# EAGLE design Eurorack_mini_psu (EAGLE 7.5.0)
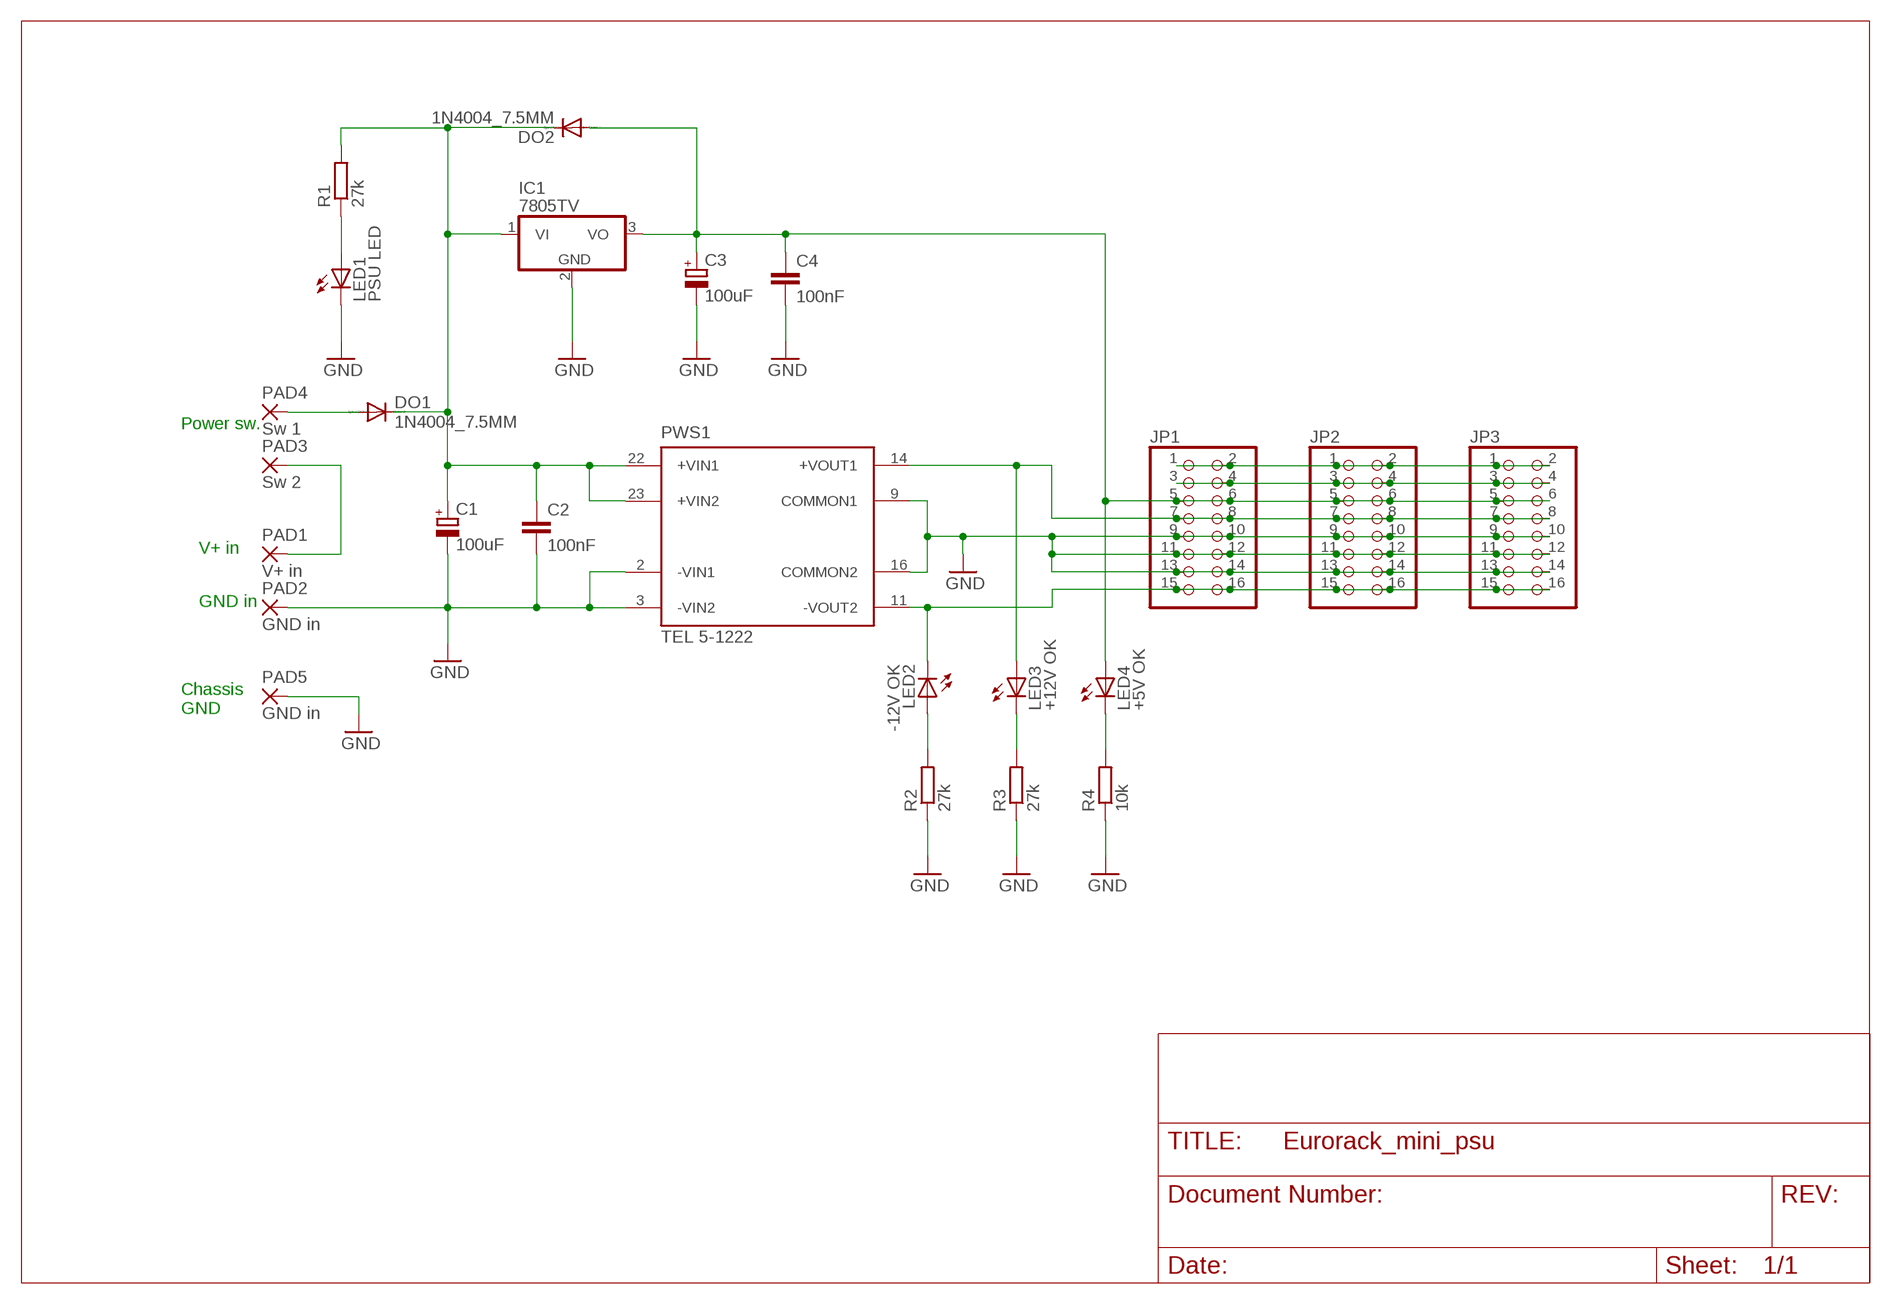
[diagram p0: schematic, sheet 1]

## Parts
C1  100uF  CPOL-EUE2.5-6  [E2,5-6]
C2  100nF  C-EU025-025X050  [C025-025X050]
C3  100uF  CPOL-EUE2.5-6  [E2,5-6]
C4  100nF  C-EU025-025X050  [C025-025X050]
DO1  1N4004_7.5MM  [DO41-7]
DO2  1N4004_7.5MM  [DO41-7]
IC1  7805TV  [TO220V]
JP1  PINHD-2X8  [2X08]
JP2  PINHD-2X8  [2X08]
JP3  PINHD-2X8  [2X08]
LED1  PSU LED  LED3MM  [LED3MM]
LED2  -12V OK  LED3MM  [LED3MM]
LED3  +12V OK  LED3MM  [LED3MM]
LED4  +5V OK  LED3MM  [LED3MM]
PAD1  V+ in  2,15/1,0  [2,15/1,0]
PAD2  GND in  2,15/1,0  [2,15/1,0]
PAD3  Sw 2  2,15/1,0  [2,15/1,0]
PAD4  Sw 1  2,15/1,0  [2,15/1,0]
PAD5  GND in  2,15/1,0  [2,15/1,0]
PWS1  TEL 5-1222  TEN_3--1223  [TEN3XXXX]
R1  27k  R-EU_0207/7  [0207/7]
R2  27k  R-EU_0207/7  [0207/7]
R3  27k  R-EU_0207/7  [0207/7]
R4  10k  R-EU_0207/7  [0207/7]

## Nets
+5V: C3.+ C4.1 DO2.A IC1.3(VO) JP1.5 JP1.6 JP2.5 JP2.6 JP3.5 JP3.6 LED4.A
+12V: JP1.7 JP1.8 JP2.7 JP2.8 JP3.7 JP3.8 LED3.A PWS1.14(+VOUT1)
-12V: JP1.15 JP1.16 JP2.15 JP2.16 JP3.15 JP3.16 LED2.K(C) PWS1.11(-VOUT2)
GND: C1.- C2.2 C3.- C4.2 IC1.2(GND) JP1.9 JP1.10 JP1.11 JP1.12 JP1.13 JP1.14 JP2.9 JP2.10 JP2.11 JP2.12 JP2.13 JP2.14 JP3.9 JP3.10 JP3.11 JP3.12 JP3.13 JP3.14 LED1.K(C) PAD2.1(P) PAD5.1(P) PWS1.2(-VIN1) PWS1.3(-VIN2) PWS1.9(COMMON1) PWS1.16(COMMON2) R2.1 R3.1 R4.1
N$1: JP1.3 JP1.4 JP2.3 JP2.4 JP3.3 JP3.4
N$2: PAD1.1(P) PAD3.1(P)
N$3: DO1.A PAD4.1(P)
N$4: C1.+ C2.1 DO1.C DO2.C IC1.1(VI) PWS1.22(+VIN1) PWS1.23(+VIN2) R1.2
N$5: JP1.1 JP1.2 JP2.1 JP2.2 JP3.1 JP3.2
N$7: LED2.A R2.2
N$10: LED3.K(C) R3.2
N$11: LED4.K(C) R4.2
N$13: LED1.A R1.1

## Notes on the sheet
- Power sw.
- V+ in
- GND in
- Chassis
  GND

## Library data of the parts
C1 C3 = rcl:CPOL-EU: POLARIZED CAPACITOR, European symbol
C2 C4 = rcl:C-EU: CAPACITOR, European symbol
DO1 DO2 = lb_devs:1N4004: 1N4004 diode compact layout general purpose rectifier, 1 A
IC1 = linear:78*: Positive VOLTAGE REGULATOR Source: http://cache.national.com/ds/LM/LM78L05.pdf http://www.fairchildsemi.com/ds/LM/LM7805.pdf
JP1-JP3 = pinhead:PINHD-2X8: PIN HEADER
LED1-LED4 = led:LED: LED OSRAM: - CHIPLED LG R971, LG N971, LY N971, LG Q971, LY Q971, LO R971, LY R971 LH N974, LH R974 LS Q976, LO Q976, LY Q976 LO Q996 - Hyper CHIPLED LW Q18S LB Q993, LB Q99A, LB R99A - SideLED LS A670, LO A670, LY A670, LG A670, LP A670 LB A673, LV A673, LT A673, LW A673 LH A674 LY A675 LS A676, LA A676, LO A676, LY A676, LW A676 LS A679, LY A679, LG A679 - Hyper Micro SIDELED® LS Y876, LA Y876, LO Y876, LY Y876 LT Y87S - SmartLED LW L88C, LW L88S LB L89C, LB L89S, LG L890 LS L89K, LO L89K, LY L89K LS L896, LA L896, LO L896, LY L896 - TOPLED LS T670, LO T670, LY T670, LG T670, LP T670 LSG T670, LSP T670, LSY T670, LOP T670, LYG T670 LG T671, LOG T671, LSG T671 LB T673, LV T673, LT T673, LW T673 LH T674 LS T676, LA T676, LO T676, LY T676, LB T676, LH T676, LSB T676, LW T676 LB T67C, LV T67C, LT T67C, LS T67K, LO T67K, LY T67K, LW E67C LS E67B, LA E67B, LO E67B, LY E67B, LB E67C, LV E67C, LT E67C LW T67C LS T679, LY T679, LG T679 LS T770, LO T770, LY T770, LG T770, LP T770 LB T773, LV T773, LT T773, LW T773 LH T774 LS E675, LA E675, LY E675, LS T675 LS T776, LA T776, LO T776, LY T776, LB T776 LHGB T686 LT T68C, LB T68C - Hyper Mini TOPLED® LB M676 - Mini TOPLED Santana® LG M470 LS M47K, LO M47K, LY M47K Source: http://www.osram.convergy.de LUXEON: - LUMILED® LXK2-PW12-R00, LXK2-PW12-S00, LXK2-PW14-U00, LXK2-PW14-V00 LXK2-PM12-R00, LXK2-PM12-S00, LXK2-PM14-U00 LXK2-PE12-Q00, LXK2-PE12-R00, LXK2-PE12-S00, LXK2-PE14-T00, LXK2-PE14-U00 LXK2-PB12-K00, LXK2-PB12-L00, LXK2-PB12-M00, LXK2-PB14-N00, LXK2-PB14-P00, LXK2-PB14-Q00 LXK2-PR12-L00, LXK2-PR12-M00, LXK2-PR14-Q00, LXK2-PR14-R00 LXK2-PD12-Q00, LXK2-PD12-R00, LXK2-PD12-S00 LXK2-PH12-R00, LXK2-PH12-S00 LXK2-PL12-P00, LXK2-PL12-Q00, LXK2-PL12-R00 Source: www.luxeon.com KINGBRIGHT: KA-3528ASYC Source: www.kingbright.com
PAD1-PAD5 = wirepad:2,15/1,0: THROUGH-HOLE PAD
PWS1 = traco-electronic:TEN_3--*: DC/DC Konverter 3 Watt, 2 x Input, 2 x Output Source: http://www.tracopower.com/datasheet_g/ten3-d.pdf; OC_FARNELL: unknown; OC_NEWARK: unknown
R1-R4 = rcl:R-EU_: RESISTOR, European symbol

## Board
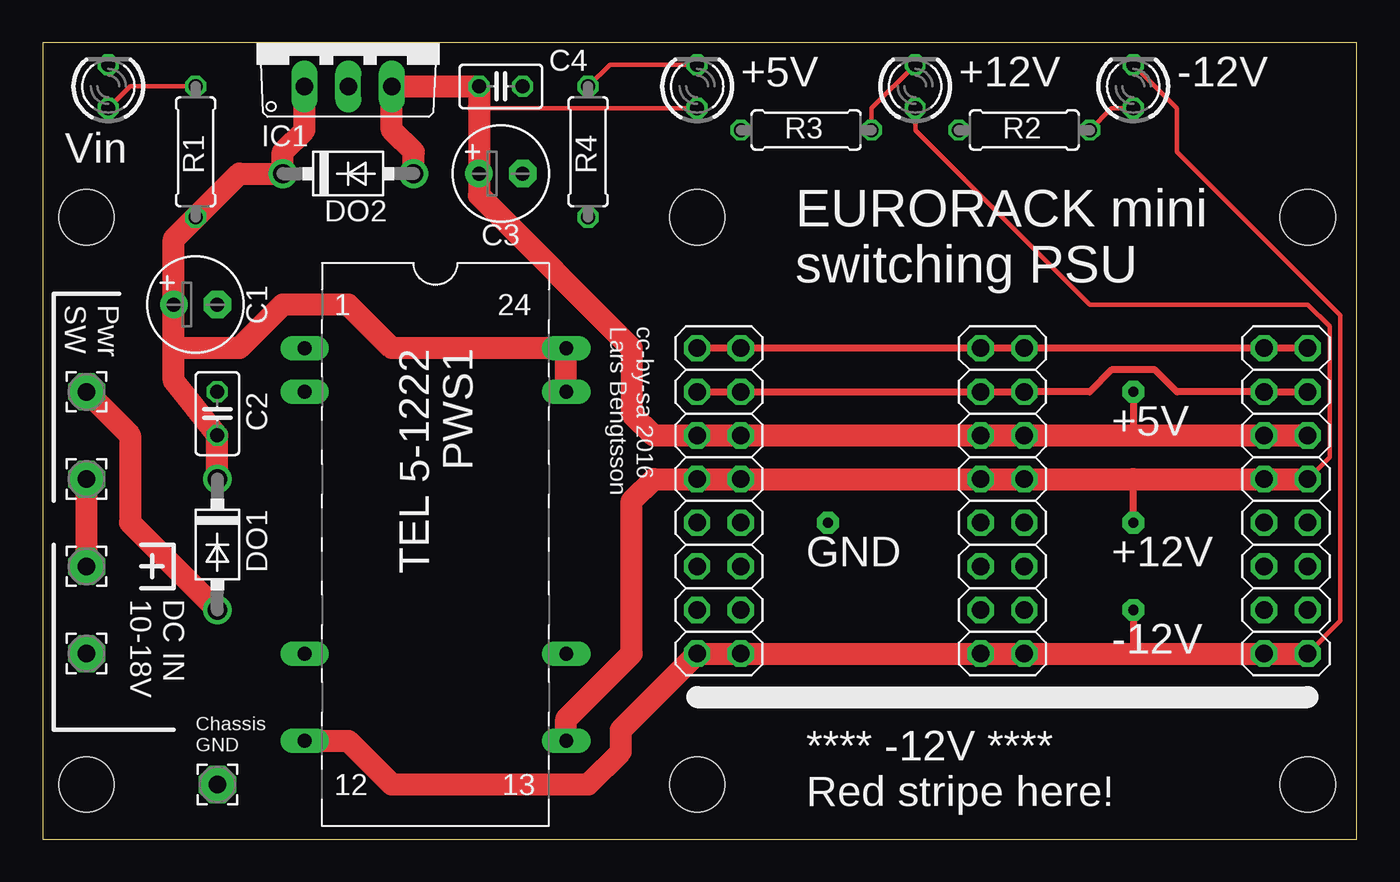
[diagram p1: board, top side]
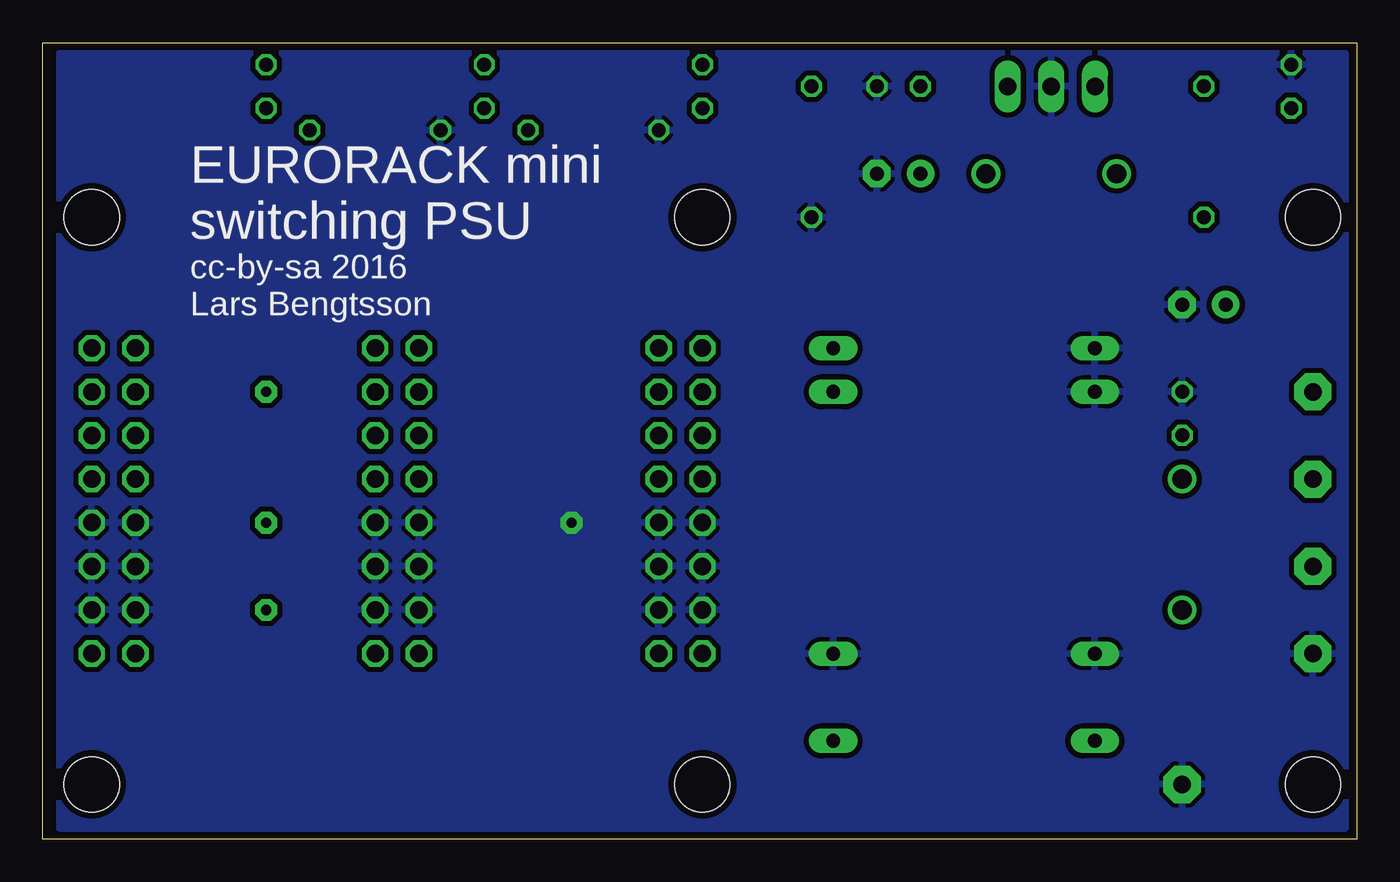
[diagram p2: board, bottom side, seen from below]

Size 76.5 x 46.34 mm. Coordinates in mm from the lower left corner, seen from the top.
Outline: 0,0 76.5,0 76.5,46.34 0,46.34 0,0
Copper layers (1*16): Top 0.0356mm / dielectric 1.5011mm / Bottom 0.0356mm
Design rules "LaenPCBOrder": minimum track width 6mil, minimum drill 13mil, track to track 6mil, track to pad 6mil, pad to pad 6mil, via to via 6mil, smd to smd 6mil, copper to edge 15mil, drill to drill 6mil, minimum pad ring 7mil, minimum via ring 7mil, stop-mask expansion 3mil, vias tented up to drill 0mil, thermal gap 10mil
Holes 3.2 mm at 2.54,36.2 2.54,3.17 38.1,3.17 73.66,3.17 73.66,36.2 38.1,36.2

### Footprints (pad centres in the part's own frame; a part is rotated, then mirrored left to right if it is on the bottom)
E2,5-6 = drill 0.813 pad 1.6: + -1.27,0 | drill 0.813 pad 1.6 octagon: - 1.27,0
C025-025X050 = drill 0.813 octagon: 1 -1.27,0; 2 1.27,0
DO41-7 = drill 1.118: A 3.81,0; C -3.81,0
TO220V = drill 1.016 long: 1 -2.54,-2.54; 2 0,-2.54; 3 2.54,-2.54
2X08 = drill 1.016 octagon: 1 -8.89,-1.27; 2 -8.89,1.27; 3 -6.35,-1.27; 4 -6.35,1.27; 5 -3.81,-1.27; 6 -3.81,1.27; 7 -1.27,-1.27; 8 -1.27,1.27; 9 1.27,-1.27; 10 1.27,1.27; 11 3.81,-1.27; 12 3.81,1.27; 13 6.35,-1.27; 14 6.35,1.27; 15 8.89,-1.27; 16 8.89,1.27
LED3MM = drill 0.813 octagon: A -1.27,0; K 1.27,0
2,15/1,0 = drill 1.016 pad 2.159 octagon: 1 0,0
TEN3XXXX = drill 0.813 pad 1.422 long: 2 -11.43,-7.62; 3 -8.89,-7.62; 9 6.35,-7.62; 11 11.43,-7.62; 14 11.43,7.62; 16 6.35,7.62; 22 -8.89,7.62; 23 -11.43,7.62
0207/7 = drill 0.813 octagon: 1 -3.81,0; 2 3.81,0

### Placement (x,y rotation side)
C1  8.89,31.12 0 top
C2  10.16,24.77 90 top
C3  26.67,38.73 0 top
C4  26.67,43.81 0 top
DO1  10.16,17.14 270 top
DO2  17.78,38.73 0 top
IC1  17.78,46.35 0 top
JP1  55.88,19.68 270 top
JP2  39.37,19.68 270 top
JP3  72.39,19.68 270 top
LED1  3.81,43.81 90 top
LED2  63.5,43.81 90 top
LED3  50.8,43.81 90 top
LED4  38.1,43.81 90 top
PAD1  2.54,15.88 0 top
PAD2  2.54,10.79 0 top
PAD3  2.54,20.95 0 top
PAD4  2.54,26.04 0 top
PAD5  10.16,3.17 0 top
PWS1  22.86,17.14 270 top
R1  8.89,40 270 top
R2  57.15,41.27 0 top
R3  44.45,41.27 0 top
R4  31.75,40 90 top

### Tracks (layer width: path | path; a pad name or v marks a point on that pad's centre or on a via)
+5V  (via drill 0.6 pad 1.27)
  Top 0.254: LED4.A 25.4,42.55
  Top 0.406: v63.5,26.04 63.5,23.49
  Top 1.27: DO2.A 21.59,40 20.32,41.27 IC1.3 C4.1 25.4,42.55 C3.+ 25.4,37.46 34.29,28.57 34.29,24.77 35.56,23.49 JP2.5 JP2.6 JP1.5 JP1.6 63.5,23.49 JP3.5 JP3.6
+12V  (via drill 0.6 pad 1.27)
  Top 0.254: JP3.8 74.93,22.22 74.93,29.84 73.66,31.12 60.96,31.12 50.8,41.27 LED3.A
  Top 0.406: v63.5,18.41 63.5,20.95
  Top 1.27: JP3.8 JP3.7 63.5,20.95 JP1.8 JP1.7 JP2.8 JP2.7 35.56,20.95 34.29,19.68 34.29,10.79 30.48,6.99 PWS1.14
-12V  (via drill 0.6 pad 1.27)
  Top 0.254: JP3.16 75.56,12.7 75.56,30.48 66.04,40 66.04,42.55 LED2.K
  Top 0.406: v63.5,13.34 63.5,10.79
  Top 1.27: PWS1.11 17.78,5.71 20.32,3.17 31.75,3.17 33.66,5.08 33.66,6.35 JP2.15 JP2.16 JP1.15 JP1.16 63.5,10.79 JP3.15 JP3.16
GND  (via drill 0.6 pad 1.27)
  other vias: 45.72,18.41
  pour Bottom (isolate 0.305): 0.63,45.72 75.56,45.72 75.56,0.64 0.63,0.64
N$1
  Top 0.406: JP2.3 JP2.4 JP1.3 JP1.4 60.96,26.04 62.23,27.3 64.77,27.3 66.04,26.04 JP3.3 JP3.4
N$2
  Top 1.27: PAD1.1 PAD3.1
N$3
  Top 1.27: PAD4.1 5.08,23.49 5.08,18.41 DO1.A
N$4
  Top 1.27: DO1.C C2.1 7.62,26.67 7.62,28.57 | 7.62,28.57 C1.+ 7.62,34.92 R1.2 11.43,38.73 DO2.C 13.97,40 15.24,41.27 IC1.1 | PWS1.22 PWS1.23 20.32,28.57 17.78,31.12 13.97,31.12 11.43,28.57 7.62,28.57
N$5
  Top 0.406: JP3.2 JP3.1 JP1.2 JP1.1 JP2.2 JP2.1
N$7
  Top 0.254: LED2.A 62.23,42.55 R2.2
N$10
  Top 0.254: LED3.K 48.26,42.55 R3.2
N$11
  Top 0.254: LED4.K 33.02,45.09 R4.2
N$13
  Top 0.254: R1.1 5.08,43.81 LED1.A

### Text on the board
tNames: +5V | +12V | -12V | Vin | EURORACK mini / switching PSU | Pwr / SW | cc-by-sa 2016 / Lars Bengtsson | +5V | GND | +12V | DC IN / 10-18V | -12V | Chassis / GND | **** -12V **** / Red stripe here!
bNames: EURORACK mini / switching PSU | cc-by-sa 2016 / Lars Bengtsson